# Altium schematic sheet Structure.SchDoc
size 420 x 297 mm; Address1: Address1; Address2: Address2; Address3: Address3; Address4: Address4; DocumentNumber: АБВГ.123456.001 Э3; SheetNumber: 1; Scale: 1:1; DocumentType: Схема электрическая принципиальная; FirstReferrence: АБВГ.123456.001
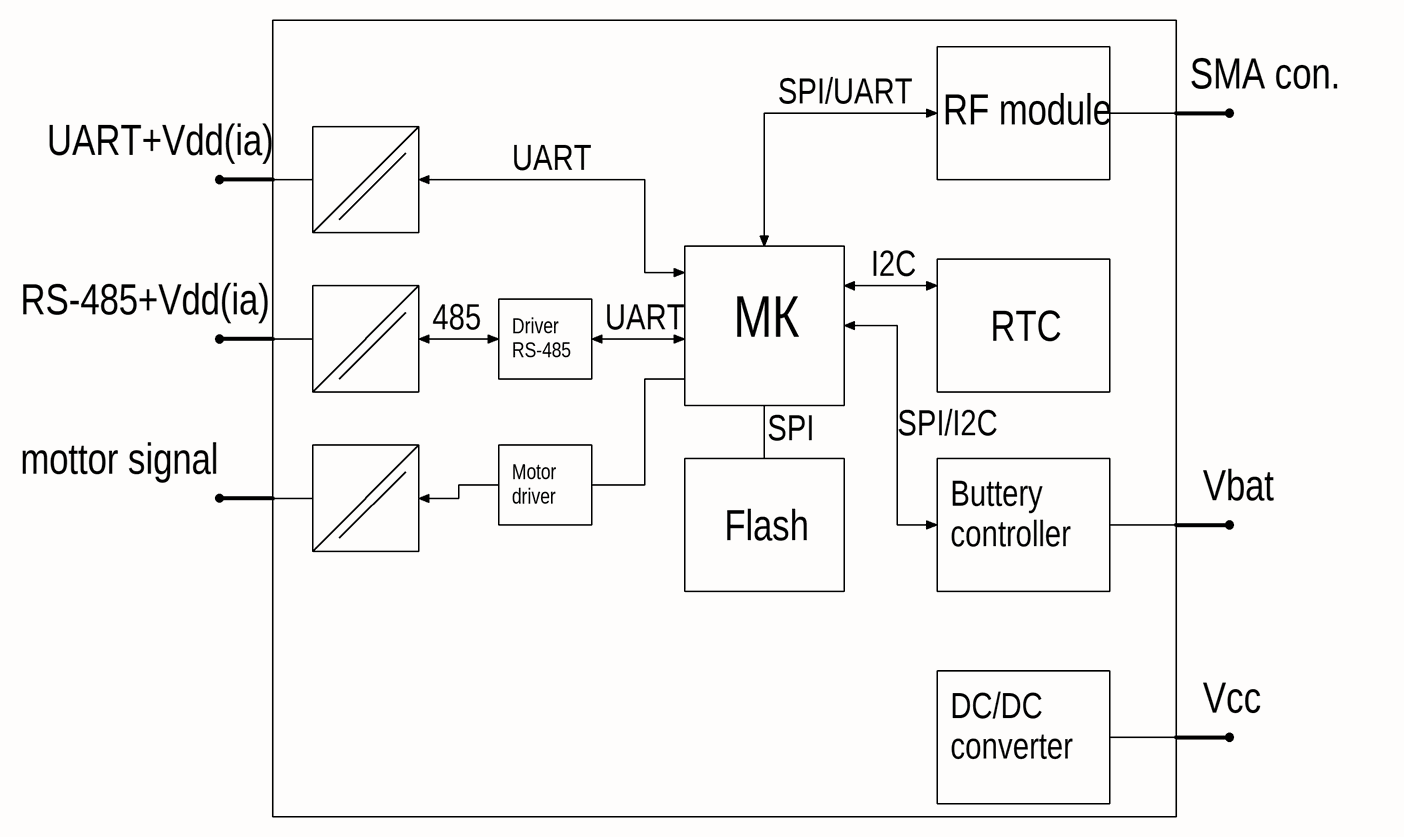
[diagram p0: Structure.SchDoc]

## Notes on the sheet
- SPI/UART
- SMA con.
- UART+Vdd(ia)
- UART
- RF module
- I2C
- RS-485+Vdd(ia)
- 485
- Driver
  RS-485
- МК
- RTC
- SPI
- SPI/I2C
- mottor signal
- Motor
  driver
- Vbat
- Flash
- Buttery
  controller
- DC/DC
  converter
- Vcc
- Перв. примен.
- Справ. №
- Подп. и дата
- Инв. № дубл.
- Взам. инв. №
- Разраб.
- Изм.
- Лист
- № докум.
- Подп.
- Дата
- Лит.
- Масса
- Масштаб
- Пров.
- Т.контр.
- Листов
- Инв. № подл.
- Утв.
- Н.контр.
- 2.106-A3
- Копировал
- Формат А3